# Altium schematic sheet [02] - BLOCK DIAGRAM.SchDoc: RK3399 COB Design V1.0
size A3; PageSetup: Record=PageOptions|CenterHorizontal=True|CenterVertical=True|PrintScale=0.52|XCorrection=1.00|YCorrection=1.00|PrintKind=1|BorderSize=5000000|LeftOffset=0|BottomOffset=0|Orientation=2|PaperLength=1000|PaperWidth=1000|Scale=100|PaperSource=4|PrintQuality=600|MediaType=1|DitherType=10|PrintScaleMode=1|PaperKind=A4|PaperIndex=9; Author: ABC; Organization: Altium Limited; Address1: L3, 12a Rodborough Rd; Address2: Frenchs Forest; Address3: NSW; Address4: Australia 2086; DocumentNumber: 1; SheetNumber: 1; SheetTotal: 1; PROJECT CODE: A_V1.0
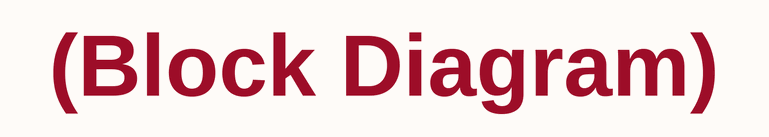
[diagram p0: [02] - BLOCK DIAGRAM.SchDoc]

## Notes on the sheet
- (Block Diagram)
- TITLE:
- DOCUMENT NAME:
- PROJECT CODE:
- Sheet
- of
- SCALE 1:1
- © PATECH 2023
- TEMPLATE:
- CEO: Alireza Jahanbakhshi
- A4
- AUTHOR: